# Altium project power_distrubtion.PrjPCB
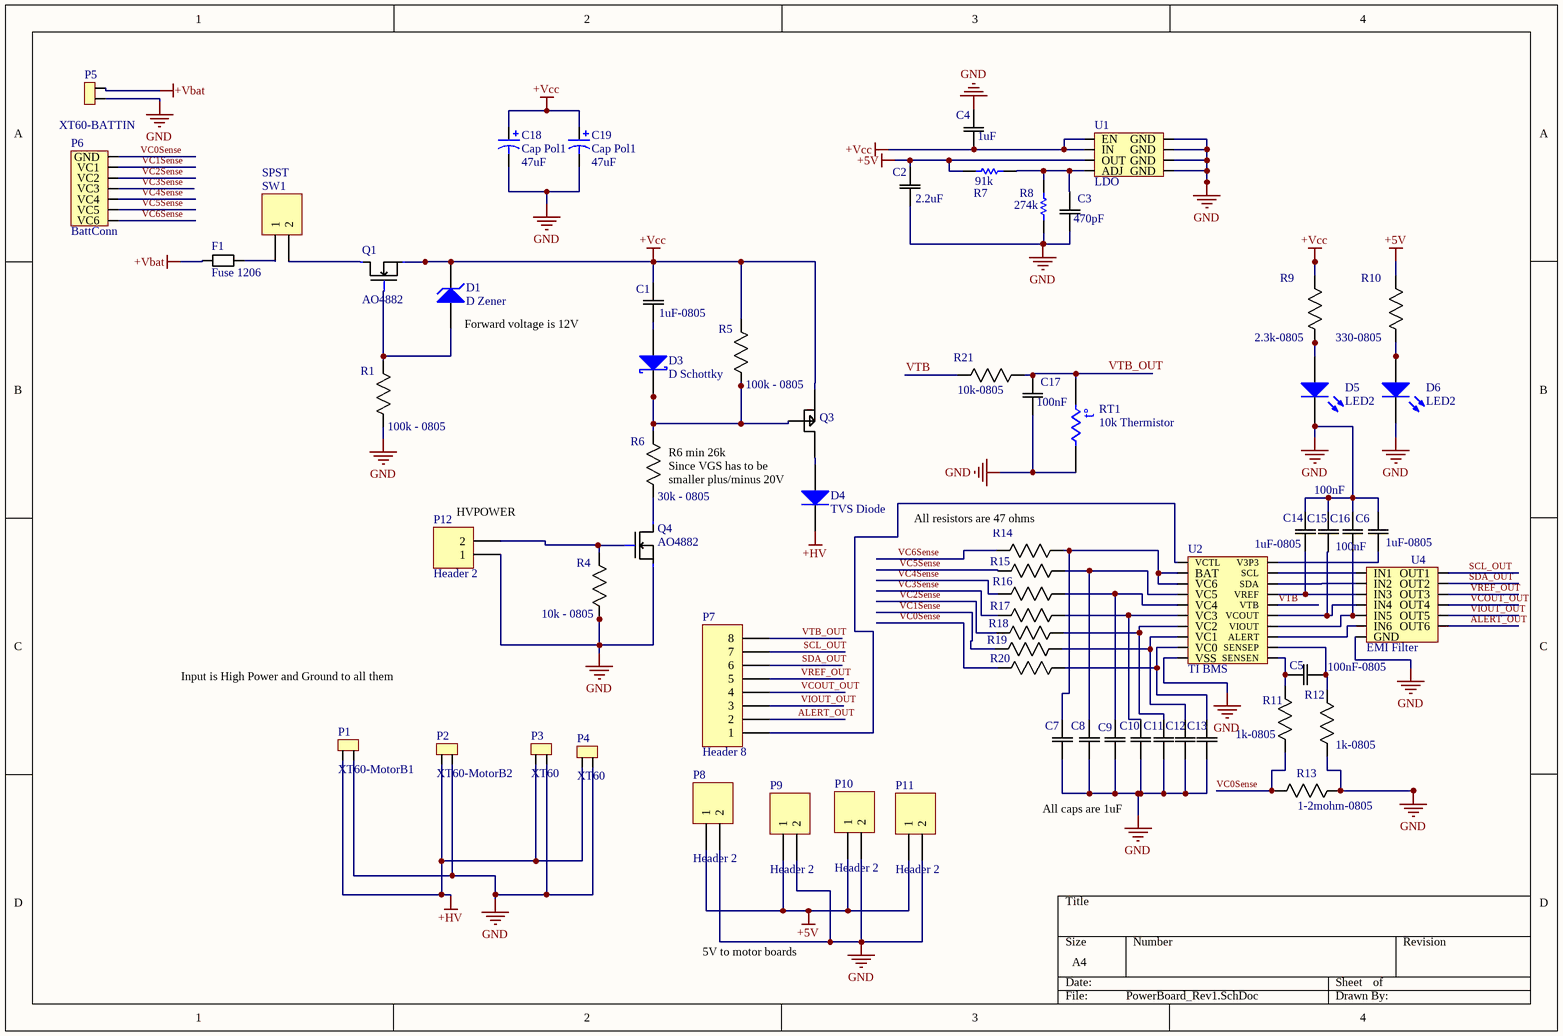
[diagram p0: PowerBoard_Rev1.SchDoc]
1 sheet, 64 parts. Net scope: global (net labels, ports and power ports of the same name join across sheets).
Board file: PowerBoard.PcbDoc

## Sheet PowerBoard_Rev1.SchDoc
size A4

### Parts
C1  1uF-0805  [CAPC2013X110N]
C2  2.2uF  [CAPC2013X110N]
C3  470pF  [CAPC2013X110N]
C4  1uF  [CAPC2013X110N]
C5  100nF-0805  [CAPC2013X110N]
C6  1uF-0805  [CAPC2013X110N]
C7  1uF-0805  [CAPC2013X110N]  (value not drawn)
C8  1uF-0805  [CAPC2013X110N]  (value not drawn)
C9  1uF-0805  [CAPC2013X110N]  (value not drawn)
C10  1uF-0805  [CAPC2013X110N]  (value not drawn)
C11  1uF-0805  [CAPC2013X110N]  (value not drawn)
C12  1uF-0805  [CAPC2013X110N]  (value not drawn)
C13  1uF-0805  [CAPC2013X110N]  (value not drawn)
C14  1uF-0805  [CAPC2013X110N]
C15  100nF  [CAPC2013X110N]
C16  100nF  [CAPC2013X110N]
C17  100nF  [CAPC2013X110N]
C18  Cap Pol1  value 47uF  [RB7.6-15]
C19  Cap Pol1  value 47uF  [RB7.6-15]
D1  D Zener  [DIODE-0.7]
D3  D Schottky  [SMB]
D4  TVS Diode  [DO-35]
D5  LED2  [3.2X1.6X1.1]
D6  LED2  [3.2X1.6X1.1]
F1  Fuse 1206  [PCBComponent_1]
P1  XT60-MotorB1  [PCBComponent_1]
P2  XT60-MotorB2  [PCBComponent_1]
P3  XT60  [PCBComponent_1]
P4  XT60  [PCBComponent_1]
P5  XT60-BATTIN  [PCBComponent_1]
P6  BattConn  [6sBattConn]
P7  Header 8  [HDR1X8]
P8  Header 2  [HDR1X2]
P9  Header 2  [HDR1X2]
P10  Header 2  [HDR1X2]
P11  Header 2  [HDR1X2]
P12  Header 2  [HDR1X2]
Q1  AO4882  [SOIC127P600X170-8N]
Q3  Mosfet P Channel  [SOIC127P600X170-8N]  (value not drawn)
Q4  AO4882  [SOIC127P600X170-8N]
R1  100k - 0805  [RESC2013X65N]
R4  10k - 0805  [RESC2013X65N]
R5  100k - 0805  [RESC2013X65N]
R6  30k - 0805  [RESC2013X65N]
R7  91k  [AXIAL-0.3]
R8  274k  [AXIAL-0.3]
R9  2.3k-0805  [RESC2013X65N]
R10  330-0805  [RESC2013X65N]
R11  1k-0805  [RESC2013X65N]
R12  1k-0805  [RESC2013X65N]
R13  1-2mohm-0805  [RESC2013X65N]
R14  47-0805  [RESC2013X65N]  (value not drawn)
R15  47-0805  [RESC2013X65N]  (value not drawn)
R16  47-0805  [RESC2013X65N]  (value not drawn)
R17  47-0805  [RESC2013X65N]  (value not drawn)
R18  47-0805  [RESC2013X65N]  (value not drawn)
R19  47-0805  [RESC2013X65N]  (value not drawn)
R20  47-0805  [RESC2013X65N]  (value not drawn)
R21  10k-0805  [RESC2013X65N]
RT1  10k Thermistor  [6-0805_N]
SW1  SPST  [HDR1X2]
U1  LDO  [SOIC127P600X170-8N]
U2  TI BMS  [TSOP65P640X120-20N]
U4  EMI Filter  [Filter]

### Nets
+5V: C2.2(C2) P8.1 P9.1 P10.1 P11.1 R7.1 R10.2(R2) U1.OUT
+HV: D4.2(K) P1.1 P2.1 P3.1 P4.1
+Vbat: F1.1 P5.2
+Vcc: C1.2(C2) C4.1(C1) C18.1 C19.1 D1.2(K) Q1.S Q3.S R5.1(R1) R9.2(R2) U1.EN U1.IN
GND: C2.1(C1) C3.1(C1) C4.2(C2) C6.2(C2) C7.1(C1) C8.1(C1) C9.1(C1) C10.1(C1) C11.1(C1) C12.1(C1) C13.1(C1) C14.2(C2) C15.2(C2) C16.2(C2) C17.1(C1) C18.2 C19.2 D5.2(K) D6.2(K) P1.2 P2.2 P3.2 P4.2 P5.1 P8.2 P9.2 P10.2 P11.2 P12.1 Q4.S R1.2(R2) R4.2(R2) R8.2 R12.2(R2) R13.2(R2) RT1.2 U1.GND U2.VSS U4.GND
ALERT_OUT: P7.2 U4.12(OUT6)
SCL_OUT: P7.7 U4.7(OUT1)
SDA_OUT: P7.6 U4.8(OUT2)
VC0Sense: P6.GND R11.2(R2) R13.1(R1) R20.1(R1)
VC1Sense: P6.VC1 R19.1(R1)
VC2Sense: P6.VC2 R18.1(R1)
VC3Sense: P6.VC3 R17.1(R1)
VC4Sense: P6.VC4 R16.1(R1)
VC5Sense: P6.VC5 R15.1(R1)
VC6Sense: P6.VC6 R14.1(R1)
VCOUT_OUT: P7.4 U4.10(OUT4)
VIOUT_OUT: P7.3 U4.11(OUT5)
VREF_OUT: P7.5 U4.9(OUT3)
VTB: R21.1(R1) U2.VTB
VTB_OUT: C17.2(C2) P7.8 R21.2(R2) RT1.1
NetC1_1: C1.1(C1) D3.1(A)
NetC3_2: C3.2(C2) R7.2 R8.1 U1.ADJ/BYP(ADJ)
NetC5_1: C5.1(C1) R11.1(R1) U2.SENSEN
NetC5_2: C5.2(C2) R12.1(R1) U2.SENSEP
NetC6_1: C6.1(C1) U2.V3P3
NetC7_2: C7.2(C2) R14.2(R2) U2.BAT U2.VC6
NetC8_2: C8.2(C2) R15.2(R2) U2.VC5
NetC9_2: C9.2(C2) R16.2(R2) U2.VC4
NetC10_2: C10.2(C2) R17.2(R2) U2.VC3
NetC11_2: C11.2(C2) R18.2(R2) U2.VC2
NetC12_2: C12.2(C2) R19.2(R2) U2.VC1
NetC13_2: C13.2(C2) R20.2(R2) U2.VC0
NetC14_1: C14.1(C1) U2.VREF U4.3(IN3)
NetC15_1: C15.1(C1) U2.VCOUT U4.4(IN4)
NetC16_1: C16.1(C1) U2.VIOUT U4.5(IN5)
NetD1_1: D1.1(A) Q1.G R1.1(R1)
NetD3_2: D3.2(K) Q3.G R5.2(R2) R6.1(R1)
NetD4_1: D4.1(A) Q3.D
NetD5_1: D5.1(A) R9.1(R1)
NetD6_1: D6.1(A) R10.1(R1)
NetF1_2: F1.2 SW1.1
NetP7_1: P7.1 U2.VCTL
NetP12_2: P12.2 Q4.G R4.1(R1)
NetQ1_D: Q1.D SW1.2
NetQ4_D: Q4.D R6.2(R2)
NetU2_ALERT: U2.ALERT U4.6(IN6)
NetU2_SCL: U2.SCL U4.1(IN1)
NetU2_SDA: U2.SDA U4.2(IN2)

### Notes on the sheet
- (near D1) Forward voltage is 12V
- (near P12) HVPOWER
- (near Q3) R6 min 26k
  Since VGS has to be smaller plus/minus 20V
- (near R14) All resistors are 47 ohms
- Input is High Power and Ground to all them
- All caps are 1uF
- 5V to motor boards
- (in symbol Res Thermal) t°

### Library data of the parts
C1-C17 = C0805C104K5RACTU: Capacitor; Ceramic; Cap; .100UF ; Tol+-10%; SMD; Vol-Rtg 50V; X7R, Tape/Reel; MF: Kemet; Package: 0805 Kemet; Availability: Good; MP: C0805C104K5RACTU; Price: 0.86 USD; Value: *
C18 C19 = Cap Pol1: Polarized Capacitor (Radial); Published: 8-Jun-2000; LatestRevisionDate: 17-Jul-2002; LatestRevisionNote: Re-released for DXP Platform.; PackageReference: RB7.6-15; Publisher: Altium Limited; PackageDescription: Polarized Capacitor (Radial); 2 Leads
D1 = D Zener: Zener Diode; Published: 8-Jun-2000; LatestRevisionDate: 17-Jul-2002; LatestRevisionNote: Re-released for DXP Platform.; PackageReference: DIODE-0.7; Publisher: Altium Limited; PackageDescription: Diode, Thru-Hole; 2 Leads; 0.7 in Pin Spacing
D3 = D Schottky: Schottky Diode; Published: 8-Jun-2000; LatestRevisionDate: 17-Jul-2002; LatestRevisionNote: Re-released for DXP Platform.; PackageReference: SMB; Publisher: Altium Limited; PackageDescription: DO-214-AA/SMB; 2 C-Bend Leads; Body 5.3 x 3.6 mm, inc. leads (LxW); Code_JEDEC: DO-214-AA
D4 = Diode 1N914: High Conductance Fast Diode; Published: 8-Jun-2000; LatestRevisionDate: 17-Jul-2002; LatestRevisionNote: Re-released for DXP Platform.; DatasheetVersion: 1997; PackageReference: DO-35; Publisher: Altium Limited; PackageDescription: Diode, Axial; Body 3.8 x 1.9 mm (LxDia. max), Lead Dia. 0.53 mm (max); Code_JEDEC: DO-204-AH; ComponentLink1Description: Manufacturer Link; ComponentLink1URL: http://www.fairchildsemi.com/; ComponentLink2Description: Datasheet; ComponentLink2URL: http://www.fairchildsemi.com/ds/1N%2F1N4448.pdf
D5 D6 = LED2: Typical RED, GREEN, YELLOW, AMBER GaAs LED; Published: 8-Jun-2000; LatestRevisionDate: 17-Jul-2002; LatestRevisionNote: Re-released for DXP Platform.; PackageVersion: Feb-2002; PackageReference: 3.2X1.6X1.1; Publisher: Altium Limited; PackageDescription: SM LED; 2 Flat Leads
F1 = F?
P1-P6 Q1 Q4 = Component_1
P7 = Header 8: Header, 8-Pin; LatestRevisionDate: 17-Jul-2002; LatestRevisionNote: Re-released for DXP Platform.; Publisher: Altium Limited
P8-P12 = Header 2: Header, 2-Pin; LatestRevisionDate: 17-Jul-2002; LatestRevisionNote: Re-released for DXP Platform.; Publisher: Altium Limited
Q3 = Q?
R1 R4-R6 R9-R21 = RC0805FR-072K2L: Res Thick Film 0805 2.2K Ohm 1% 0.125W_1/8W_ Â}100ppm/ÂÂŽ Molded SMD Paper T/R; MF: Yageo; Availability: Good; Price: 0.01 USD; Package: 0805 Yageo; MP: RC0805FR-072K2L; SnapEDA_Link: https://www.snapeda.com/parts/RC0805FR-072K2L/Yageo/view-part/?ref=snap; Value: *
R7 R8 = Res1: Resistor; Value: 2.3K; Published: 8-Jun-2000; LatestRevisionDate: 17-Jul-2002; LatestRevisionNote: Re-released for DXP Platform.; PackageReference: AXIAL-0.3; Publisher: Altium Limited; PackageDescription: Axial Device, Thru-Hole; 2 Leads; 0.3 in Pin Spacing
RT1 = Res Thermal: 490-2456-1-ND; Published: 24-Mar-1999; LatestRevisionDate: 29-May-2009; LatestRevisionNote: IPC-7351 Footprint Added.; PackageVersion: Mar-2003; PackageReference: 6-0805; Publisher: Altium Limited; PackageDescription: Chip Resistor 0805 Case Size; Code_IPC: RESC2012
SW1 = Header 2: SPST Switch; LatestRevisionDate: 17-Jul-2002; LatestRevisionNote: Re-released for DXP Platform.; Publisher: Altium Limited
U1 U2 = U?
U4 = EMIFilter